# EAGLE design IO Shield_With_Power_Supply_PCB (EAGLE 6.4)
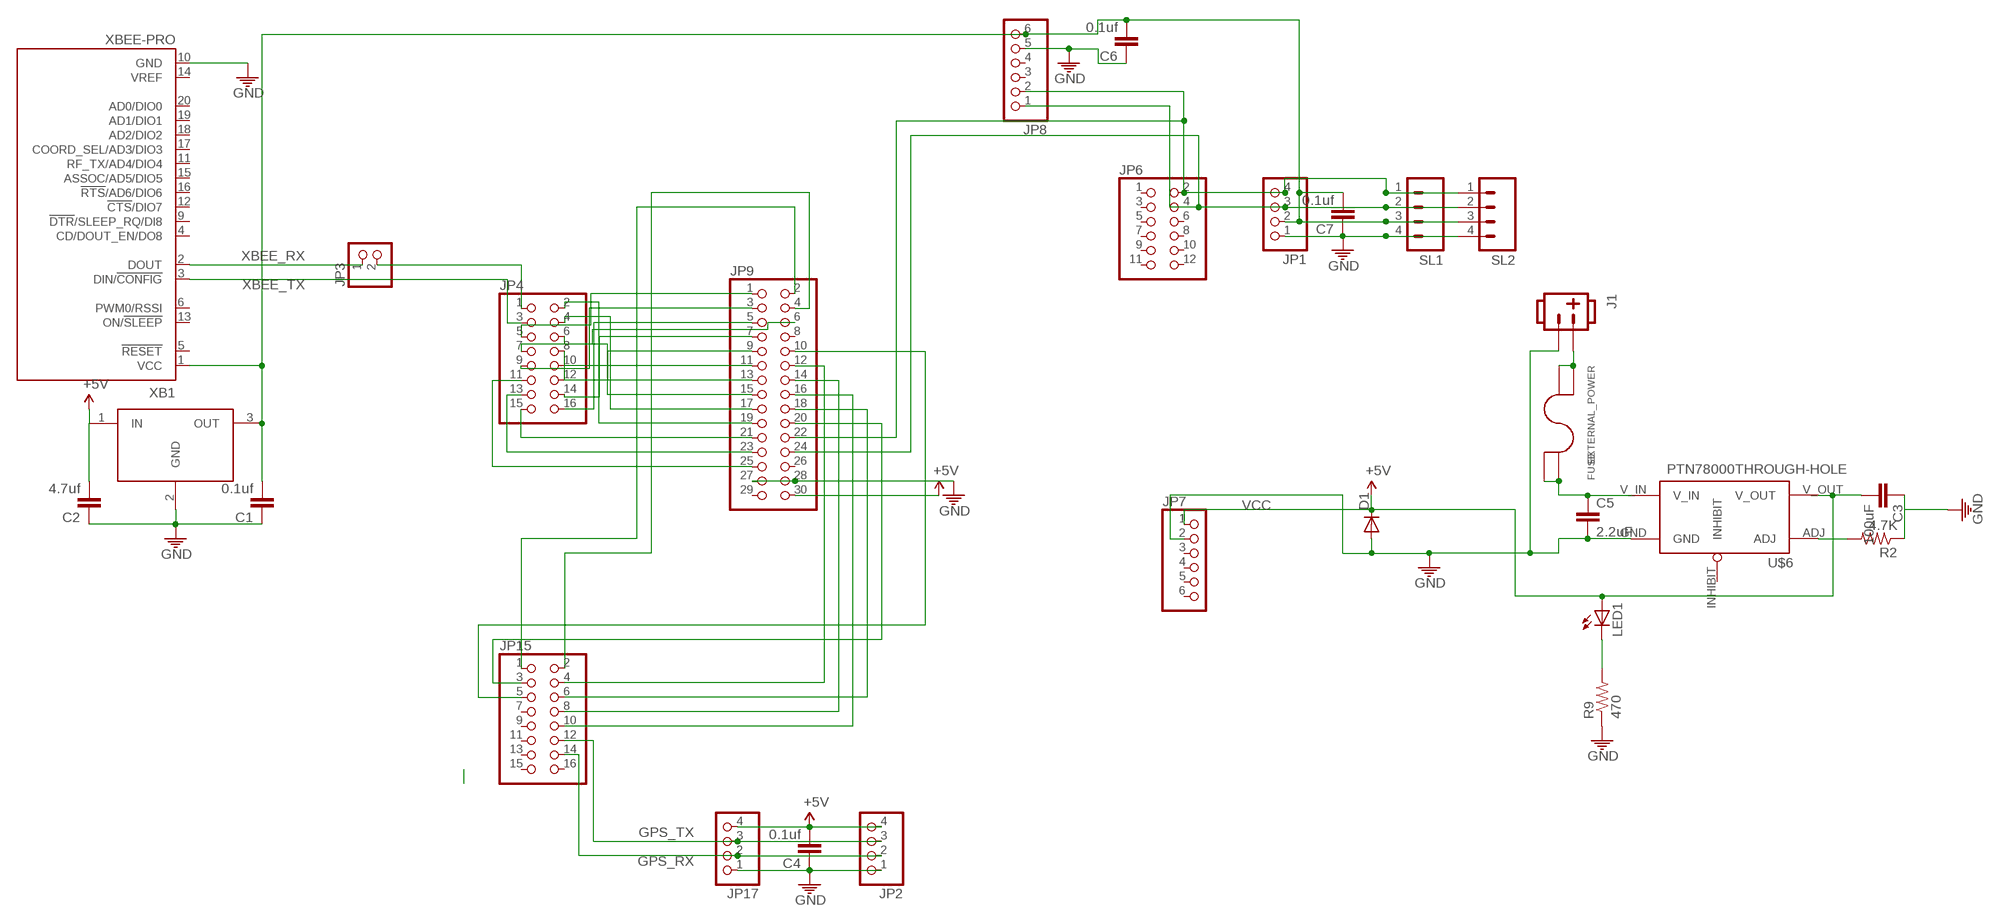
[diagram p0: schematic, sheet 1]

## Parts
C1  0.1uf  C-EUC0805  [C0805]
C2  4.7uf  C-EUC0805  [C0805]
C3  100uF  C-EUC0805  [C0805]
C4  0.1uf  C-EUC0805  [C0805]
C5  2.2uF  C-EUC0805  [C0805]
C6  0.1uf  C-EUC0805  [C0805]
C7  0.1uf  C-EUC0805  [C0805]
D1  DIODEPTH  [DIODE-1N4001]
EXTERNAL_POWER  FUSE  [FUSE_2AG]
J1  POW_CONNECTMALE  [SOCKET-MALE-3.96MM-2]
JP1  PINHD-1X4  [1X04]
JP2  PINHD-1X4/90  [1X04/90]
JP3  PINHD-1X2  [1X02]
JP4  PINHD-2X8  [2X08]
JP6  PINHD-2X6  [2X06]
JP7  PINHD-1X6  [1X06]
JP8  PINHD-1X6  [1X06]
JP9  PINHD-2X15/90  [2X15/90]
JP15  PINHD-2X8  [2X08]
JP17  PINHD-1X4  [1X04]
LED1  LED-FKIT-1206  [FKIT-LED-1206]
R2  4.7K  RESISTOR0805-RES  [0805]
R9  470  RESISTOR0805-RES  [0805]
SL1  M04LOCK  [1X04_LOCK]
SL2  M04LOCK  [1X04_LOCK]
U$6  PTN78000THROUGH-HOLE  [PTN78000]
U$7  LM3940IMP-3.3  [SOT223]
XB1  XBEE-PRO  [XBEE-PRO]

## Nets
GND: C1.1 C2.1 C3.1 C4.1 C5.2 C6.1 C7.1 D1.A J1.P$2 JP1.1 JP2.1 JP7.2 JP8.5 JP9.27 JP9.28 JP17.1 R2.1 R9.1 SL1.4 SL2.4 U$6.GND U$7.2(GND) XB1.10(GND)
GPS_RX: JP2.2 JP15.14 JP17.2
GPS_TX: JP2.3 JP15.12 JP17.3
N$1: JP3.1 XB1.2(DOUT)
N$2: JP4.5 JP9.1
N$3: EXTERNAL_POWER.P$1 EXTERNAL_POWER.P$2 J1.P$1
N$4: JP4.9 JP9.3
N$5: JP4.7 JP9.6
N$6: JP9.2 JP15.1
N$7: JP9.4 JP15.2
N$8: JP4.16 JP9.5
N$9: JP4.14 JP9.7
N$10: JP4.12 JP9.9
N$11: JP9.10 JP15.5
N$12: JP4.10 JP9.11
N$13: C1.2 C6.2 C7.2 JP1.2 JP8.6 SL1.3 SL2.3 U$7.3(OUT) XB1.1(VCC)
N$15: JP4.8 JP9.13
N$16: C5.1 EXTERNAL_POWER.P$3 EXTERNAL_POWER.P$4 U$6.V_IN
N$17: JP4.6 JP9.15
N$18: JP4.4 JP9.17
N$19: JP4.2 JP9.19
N$20: JP4.15 JP9.21
N$21: JP4.13 JP9.23
N$22: JP4.11 JP9.25
N$23: JP9.14 JP15.8
N$24: JP9.18 JP15.6
N$25: LED1.C R9.2
N$26: JP1.4 JP6.2 JP8.2 JP9.22 SL1.1 SL2.1
N$27: JP9.16 JP15.10
N$28: JP9.12 JP15.4
N$31: JP9.20 JP15.3
N$35: R2.2 U$6.ADJ
N$36: JP1.3 JP6.4 JP8.1 JP9.24 SL1.2 SL2.2
VCC: C2.2 C3.2 C4.2 D1.C JP2.4 JP7.1 JP9.30 JP17.4 LED1.A U$6.V_OUT U$7.1(IN) ; supply symbol labelled +5V
XBEE_RX: JP3.2 JP4.1
XBEE_TX: JP4.3 XB1.3(DIN/!CONFIG)
Unconnected: JP6.1 JP6.3 JP6.5 JP6.6 JP6.7 JP6.8 JP6.9 JP6.10 JP6.11 JP6.12 JP7.3 JP7.4 JP7.5 JP7.6 JP8.3 JP8.4 JP9.8 JP9.26 JP9.29 JP15.7 JP15.9 JP15.11 JP15.13 JP15.15 JP15.16 U$6.INHIBIT XB1.4(CD/DOUT_EN/DO8) XB1.5(!RESET) XB1.6(PWM0/RSSI) XB1.9(!DTR!/SLEEP_RQ/DI8) XB1.11(RF_TX/AD4/DIO4) XB1.12(!CTS!/DIO7) XB1.13(ON/!SLEEP) XB1.14(VREF) XB1.15(ASSOC/AD5/DIO5) XB1.16(!RTS!/AD6/DIO6) XB1.17(COORD_SEL/AD3/DIO3) XB1.18(AD2/DIO2) XB1.19(AD1/DIO1) XB1.20(AD0/DIO0)

## Library data of the parts
C1-C7 = resistor:C-EU: CAPACITOR, European symbol
D1 = ASL:DIODE: Diode These are standard reverse protection diodes and small signal diodes. SMA package can handle up to about 1A. SOD-323 can handle about 200mA. What the SOD-323 package when ordering, there are some mfgs out there that are 5-pin packages.
EXTERNAL_POWER = ASL:FUSE
J1 = ASL:POW_CONNECT
JP1 = pinhead_non_standard:PINHD-1X4: PIN HEADER
JP2 JP17 = pinhead:PINHD-1X4: PIN HEADER
JP3 = pinhead:PINHD-1X2: PIN HEADER
JP4 JP15 = pinhead:PINHD-2X8: PIN HEADER
JP6 = pinhead:PINHD-2X6: PIN HEADER
JP7 = pinhead:PINHD-1X6: PIN HEADER
JP8 = baro:PINHD-1X6: PIN HEADER
JP9 = pinhead:PINHD-2X15: PIN HEADER
LED1 = ASL:LED: LEDs Standard schematic elements and footprints for 5mm, 3mm, 1206, and 0603 sized LEDs. 5mm - Spark Fun Electronics SKU : COM-00529 (and others)
R2 R9 = ASL:RESISTOR: Resistor Basic schematic elements and footprints for 0603, 1206, and PTH resistors.
SL1 SL2 = ASL:M04: AMP QUICK CONNECTOR
U$6 = ASL:PTN78000: This is the PTN78000 part by Texas Instruments. It's a 1.5A adjustable switching regulator.
U$7 = LM3940:LM3940IMP-3.3: 1A Low Dropout Regulator for 5V to 3.3V Conversion
XB1 = maxstream:XBEE: XBee (TM) /XBee-PRO(TM) OEM RF Modules Source: MaxStream, Inc. xbee_productmanual.pdf; MPN: XBP24-AWI-001; OC_FARNELL: 1337916; OC_NEWARK: 42M2667

## Board
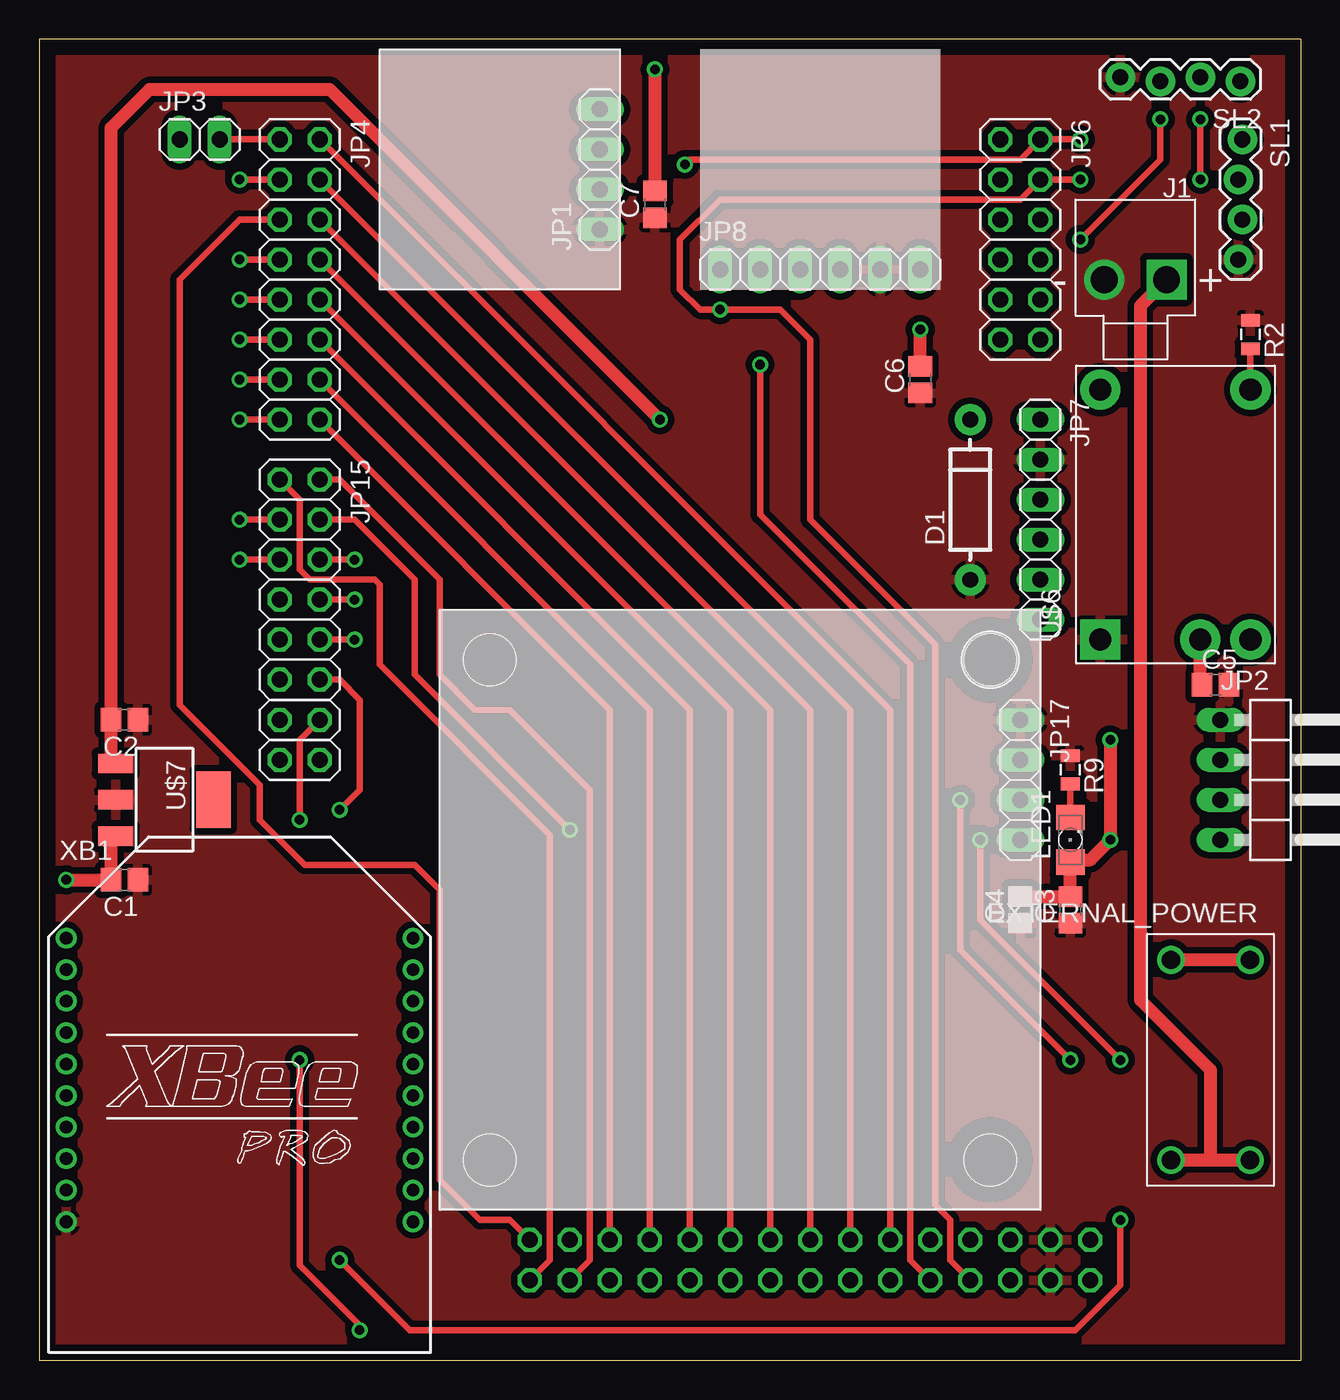
[diagram p1: board, top side]
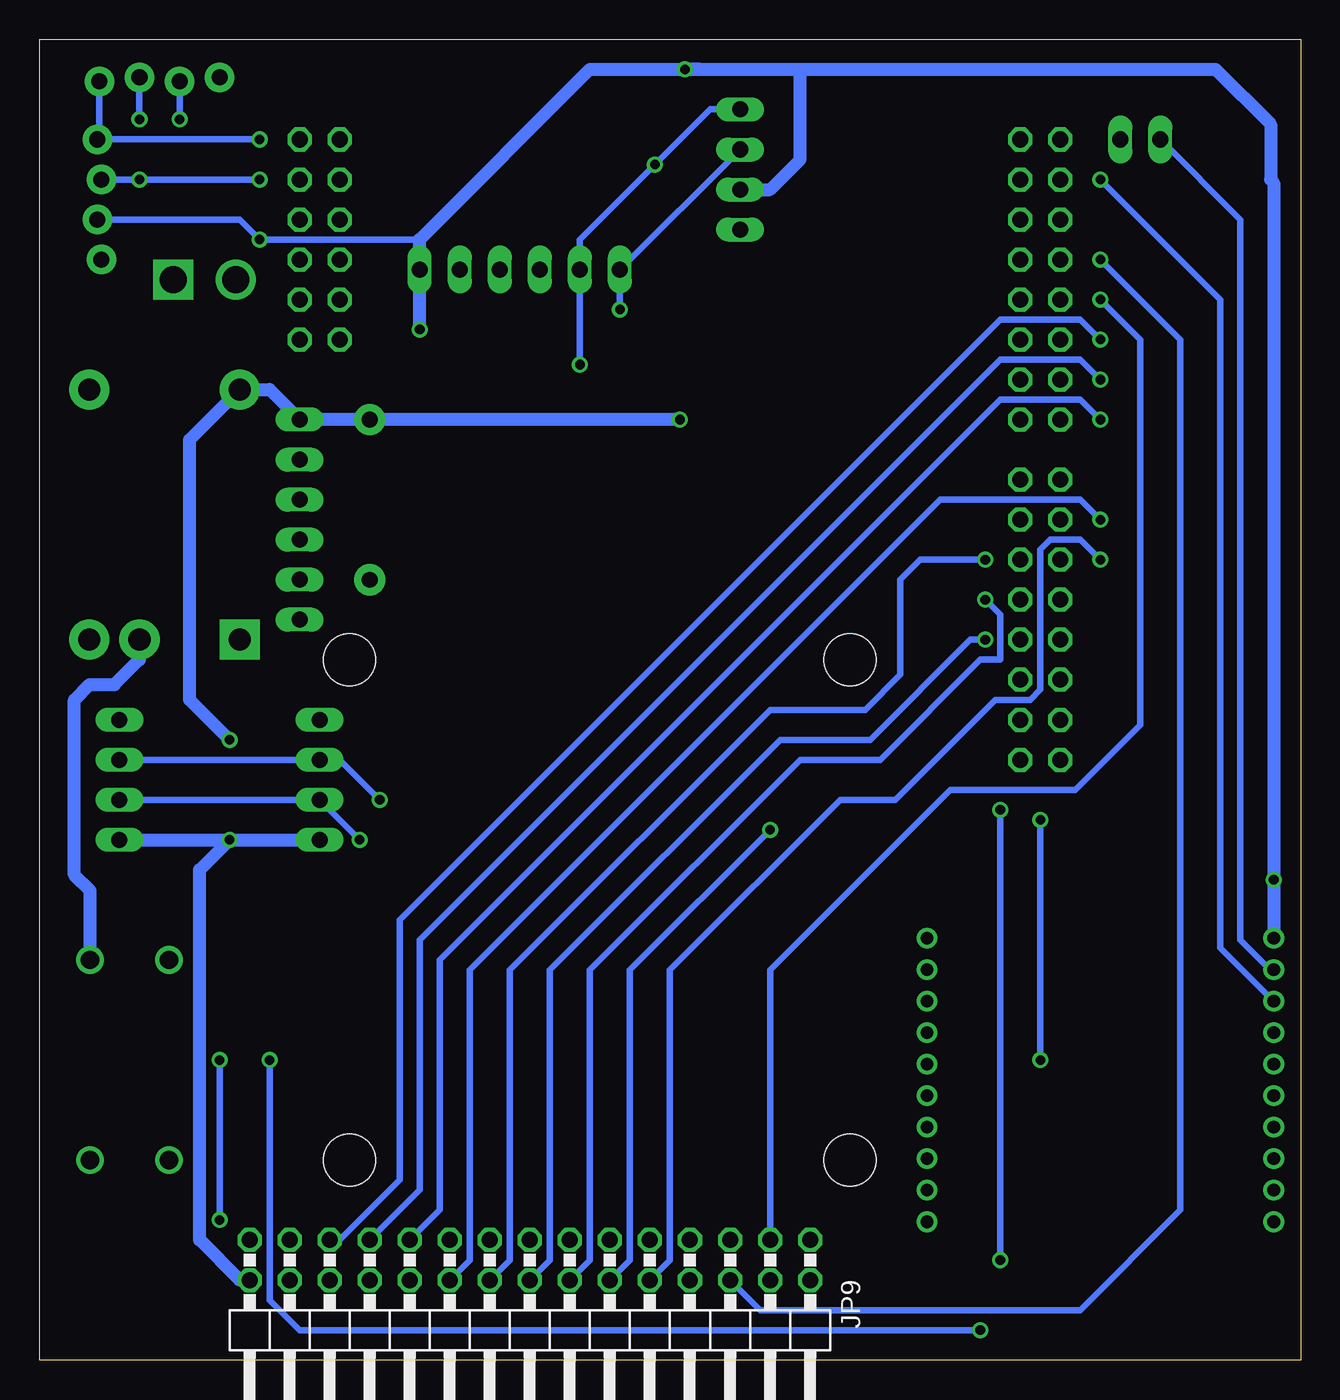
[diagram p2: board, bottom side, seen from below]

Size 80.01 x 83.82 mm. Coordinates in mm from the lower left corner, seen from the top.
Outline: 0,0 80.01,0 80.01,83.82 0,83.82 0,0
Copper layers (1*16): Top 0.035mm / dielectric 1.5mm / Bottom 0.035mm
Design rules "default *": minimum track width 10mil, minimum drill 24mil, track to track 8mil, track to pad 8mil, pad to pad 8mil, via to via 8mil, smd to smd 8mil, copper to edge 40mil, drill to drill 8mil, minimum pad ring 10mil, minimum via ring 8mil, stop-mask expansion 4mil, vias tented up to drill 0mil, thermal gap 10mil

### Footprints (pad centres in the part's own frame; a part is rotated, then mirrored left to right if it is on the bottom)
C0805 = smd 1.3 x 1.5: 1 -0.85,0; 2 0.85,0
DIODE-1N4001 = drill 1 pad 1.981: A -5.08,0; C 5.08,0
FUSE_2AG = drill 1.17: P$1 -2.5,6.35; P$2 2.5,6.35; P$3 -2.5,-6.35; P$4 2.5,-6.35
SOCKET-MALE-3.96MM-2 = drill 1.7 square: P$1 -1.98,0 | drill 1.7: P$2 1.98,0
1X04 = drill 1.016 long: 1 -3.175,0; 2 -0.635,0; 3 1.905,0; 4 4.445,0
1X04/90 = drill 1.016 long: 1 -3.81,-3.81; 2 -1.27,-3.81; 3 1.27,-3.81; 4 3.81,-3.81
1X02 = drill 1.016 long: 1 -1.27,0; 2 1.27,0
2X08 = drill 1.016 octagon: 1 -8.89,-1.27; 2 -8.89,1.27; 3 -6.35,-1.27; 4 -6.35,1.27; 5 -3.81,-1.27; 6 -3.81,1.27; 7 -1.27,-1.27; 8 -1.27,1.27; 9 1.27,-1.27; 10 1.27,1.27; 11 3.81,-1.27; 12 3.81,1.27; 13 6.35,-1.27; 14 6.35,1.27; 15 8.89,-1.27; 16 8.89,1.27
2X06 = drill 1.016 octagon: 1 -6.35,-1.27; 2 -6.35,1.27; 3 -3.81,-1.27; 4 -3.81,1.27; 5 -1.27,-1.27; 6 -1.27,1.27; 7 1.27,-1.27; 8 1.27,1.27; 9 3.81,-1.27; 10 3.81,1.27; 11 6.35,-1.27; 12 6.35,1.27
1X06 = drill 1.016 long: 1 -6.35,0; 2 -3.81,0; 3 -1.27,0; 4 1.27,0; 5 3.81,0; 6 6.35,0
2X15/90 = drill 1.016 octagon: 1 -17.78,-6.35; 2 -17.78,-3.81; 3 -15.24,-6.35; 4 -15.24,-3.81; 5 -12.7,-6.35; 6 -12.7,-3.81; 7 -10.16,-6.35; 8 -10.16,-3.81; 9 -7.62,-6.35; 10 -7.62,-3.81; 11 -5.08,-6.35; 12 -5.08,-3.81; 13 -2.54,-6.35; 14 -2.54,-3.81; 15 0,-6.35; 16 0,-3.81; 17 2.54,-6.35; 18 2.54,-3.81; 19 5.08,-6.35; 20 5.08,-3.81; 21 7.62,-6.35; 22 7.62,-3.81; 23 10.16,-6.35; 24 10.16,-3.81; 25 12.7,-6.35; 26 12.7,-3.81; 27 15.24,-6.35; 28 15.24,-3.81; 29 17.78,-6.35; 30 17.78,-3.81
FKIT-LED-1206 = smd 1.6 x 1.803: A -1.422,0; C 1.422,0
0805 = smd 0.8 x 1.2: 1 -0.9,0; 2 0.9,0
1X04_LOCK = drill 1.016 pad 1.88: 1 0,0.127; 2 2.54,-0.127; 3 5.08,0.127; 4 7.62,-0.127
STAND-OFF = hole 3.302: 0,0
PTN78000 = drill 1.397 pad 2.54: ADJ 15.875,-9.525; INHIBIT 0,-9.525; V_IN 0,-6.35; V_OUT 15.875,0 | drill 1.397 pad 2.54 square: GND 0,0
SOT223 = smd 1.219 x 2.235: 1 -2.311,-3.099; 2 0,-3.099; 3 2.311,-3.099 | smd 3.6 x 2.2: 4 0,3.099
XBEE-PRO = drill 0.8 pad 1.27: 1 -11,9; 2 -11,7; 3 -11,5; 4 -11,3; 5 -11,1; 6 -11,-1; 7 -11,-3; 8 -11,-5; 9 -11,-7; 10 -11,-9; 11 11,-9; 12 11,-7; 13 11,-5; 14 11,-3; 15 11,-1; 16 11,1; 17 11,3; 18 11,5; 19 11,7; 20 11,9

### Placement (x,y rotation side)
C1  5.4,30.48 180 top
C2  5.4,40.64 180 top
C3  65.41,28.57 90 top
C4  62.23,28.57 90 top
C5  74.61,42.86 0 top
C6  55.88,62.23 90 top
C7  39.05,73.34 90 top
D1  59.05,54.61 90 top
EXTERNAL_POWER  74.3,19.05 180 top
J1  69.53,68.58 180 top
JP1  35.56,74.93 90 top
JP2  78.74,36.83 270 top
JP3  10.16,77.47 0 top
JP4  16.51,68.58 270 top
JP6  62.23,71.12 270 top
JP7  63.5,53.34 270 top
JP8  49.53,69.21 0 top
JP9  48.89,1.27 180 bottom
JP15  16.51,46.99 270 top
JP17  62.23,37.47 270 top
LED1  65.41,33.02 90 top
R2  76.83,65.09 270 top
R9  65.41,37.47 270 top
SL1  76.2,77.47 270 top
SL2  76.2,81.28 180 top
U$2  [STAND-OFF]  60.33,12.7 0 top
U$3  [STAND-OFF]  28.57,12.7 0 top
U$4  [STAND-OFF]  28.57,44.45 0 top
U$5  [STAND-OFF]  60.33,44.45 0 top
U$6  67.31,45.72 90 top
U$7  7.94,35.56 270 top
XB1  12.7,17.78 0 top

### Tracks (layer width: path | path; a pad name or v marks a point on that pad's centre or on a via)
GND
  pour Top (isolate 0.406): 80.01,0 0,0 0,83.82 80.01,83.82
GPS_RX  (via drill 0.61)
  Top 0.406: v58.42,35.56 58.42,26.04 v65.41,19.05 | v20.32,1.91 20.32,2.22 16.51,6.03 v16.51,19.05 | JP15.14 16.51,39.37 v16.51,34.29
  Bottom 0.406: JP2.2 JP17.2 60.96,38.1 v58.42,35.56 | v65.41,19.05 65.41,3.81 63.5,1.91 v20.32,1.91 | v16.51,19.05 v16.51,34.29
GPS_TX  (via drill 0.61)
  Top 0.406: v59.69,33.02 59.69,27.94 v68.58,19.05 | v19.05,6.35 23.5,1.91 65.72,1.91 68.58,4.76 v68.58,8.89 | v19.05,34.93 20.32,36.2 20.32,41.91 19.05,43.18 JP15.12
  Bottom 0.406: JP2.3 JP17.3 v59.69,33.02 | v19.05,6.35 v19.05,34.93 | v68.58,19.05 v68.58,8.89
N$1
  Bottom 0.406: JP3.1 3.81,72.39 3.81,26.67 1.92,24.78 XB1.2
N$2
  Top 0.406: JP9.1 29.85,8.89 27.94,8.89 25.4,11.43 25.4,29.84 23.81,31.43 16.83,31.43 13.97,34.29 13.97,36.51 8.89,41.59 8.89,68.58 12.7,72.39 JP4.5
N$3
  Top 0.813: EXTERNAL_POWER.P$2 74.3,12.7 | 74.3,12.7 EXTERNAL_POWER.P$1 | J1.P$1 69.85,66.92 69.85,22.86 74.3,18.41 74.3,12.7
N$4  (via drill 0.61)
  Top 0.406: v12.7,67.31 JP4.9
  Bottom 0.406: JP9.3 33.66,24.77 22.23,36.2 14.29,36.2 10.16,40.32 10.16,64.77 v12.7,67.31
N$5  (via drill 0.61)
  Top 0.406: v12.7,69.85 JP4.7
  Bottom 0.406: JP9.6 34.29,3.17 13.97,3.17 7.62,9.53 7.62,64.77 v12.7,69.85
N$6
  Top 0.406: JP9.2 32.38,6.35 32.38,33.34 21.59,44.13 21.59,49.21 21.27,49.53 17.14,49.53 16.51,50.17 16.51,54.61 JP15.1
N$7
  Top 0.406: JP9.4 34.92,6.35 34.92,36.2 29.85,41.28 27.62,41.28 25.4,43.5 25.4,49.53 19.05,55.88 JP15.2
N$8
  Top 0.406: JP9.5 36.2,41.28 JP4.16
N$9
  Top 0.406: JP9.7 38.73,41.28 JP4.14
N$10
  Top 0.406: JP4.12 41.27,41.28 JP9.9
N$11  (via drill 0.61)
  Top 0.406: v12.7,50.8 JP15.5
  Bottom 0.406: JP9.10 40,6.35 40,24.77 29.21,35.56 25.72,35.56 19.37,41.91 17.14,41.91 16.51,42.55 16.51,51.44 15.87,52.07 13.97,52.07 v12.7,50.8
N$12
  Top 0.406: JP4.10 43.81,41.28 JP9.11
N$13  (via drill 0.61)
  Top 0.406: v71.12,78.74 71.12,76.2 v66.04,71.12
  Top 0.813: v1.7,30.48 C1.2 4.55,32.96 U$7.3 | C6.2 v55.88,65.41 | v39.05,81.91 C7.2
  Bottom 0.406: 55.88,71.12 v66.04,71.12 67.31,72.39 SL1.3 | SL2.3 v71.12,78.74
  Bottom 0.813: 38.1,81.91 v39.05,81.91 | v39.05,81.91 31.75,81.91 | 31.75,81.91 5.4,81.91 1.9,78.42 1.9,74.93 1.7,74.72 v1.7,30.48 XB1.1 | v39.05,81.91 45.09,81.91 55.88,71.12 JP8.6 v55.88,65.41 | JP1.2 33.66,74.3 31.75,76.2 31.75,81.91
N$15
  Top 0.406: JP4.8 46.35,41.28 JP9.13
N$16
  Top 0.813: EXTERNAL_POWER.P$3 EXTERNAL_POWER.P$4 | C5.1 73.66,42.97 U$6.V_IN
  Bottom 0.813: EXTERNAL_POWER.P$3 76.8,29.8 77.79,30.8 77.79,41.91 76.83,42.86 75.25,42.86 73.66,44.45 U$6.V_IN
N$17
  Top 0.406: JP4.6 48.89,41.28 JP9.15
N$18
  Top 0.406: JP4.4 51.43,41.28 JP9.17
N$19
  Top 0.406: JP9.19 53.97,41.28 JP4.2
N$20  (via drill 0.61)
  Top 0.406: v12.7,59.69 JP4.15
  Bottom 0.406: JP9.21 54.61,9.53 54.61,25.4 19.05,60.96 13.97,60.96 v12.7,59.69
N$21  (via drill 0.61)
  Top 0.406: v12.7,62.23 JP4.13
  Bottom 0.406: JP9.23 55.88,10.79 55.88,26.67 19.05,63.5 13.97,63.5 v12.7,62.23
N$22  (via drill 0.61)
  Top 0.406: v12.7,64.77 JP4.11
  Bottom 0.406: JP9.25 60.96,7.62 57.15,11.43 57.15,27.94 19.05,66.04 13.97,66.04 v12.7,64.77
N$23  (via drill 0.61)
  Top 0.406: v20,48.26 JP15.8
  Bottom 0.406: JP9.14 45.09,6.35 45.09,24.77 31.75,38.1 26.67,38.1 20.32,44.45 19.05,44.45 19.05,47.31 v20,48.26
N$24  (via drill 0.61)
  Top 0.406: v20,50.8 JP15.6
  Bottom 0.406: JP9.18 50.16,6.35 50.16,24.77 33.66,41.28 27.62,41.28 25.4,43.5 25.4,49.53 24.13,50.8 v20,50.8
N$25
  Top 0.406: LED1.C R9.2
N$26  (via drill 0.61)
  Top 0.406: JP9.22 55.24,6.35 55.24,44.13 45.72,53.66 v45.72,63.18 | v40.96,75.88 41.27,76.2 62.23,76.2 JP6.2 v66.04,77.47
  Bottom 0.406: v45.72,63.18 JP8.2 45.72,71.12 v40.96,75.88 37.46,79.38 JP1.4 | v66.04,77.47 SL1.1 76.2,77.6 SL2.1
N$27  (via drill 0.61)
  Top 0.406: v20,45.72 JP15.10
  Bottom 0.406: JP9.16 47.62,6.35 47.62,24.77 33.02,39.37 27.3,39.37 20.96,45.72 v20,45.72
N$28  (via drill 0.61)
  Top 0.406: JP15.4 20,53.34 23.81,49.53 23.81,43.5 v33.66,33.66
  Bottom 0.406: v33.66,33.66 42.54,24.77 42.54,6.35 JP9.12
N$31  (via drill 0.61)
  Top 0.406: v12.7,53.34 JP15.3
  Bottom 0.406: JP9.20 52.7,6.35 52.7,24.77 22.86,54.61 13.97,54.61 v12.7,53.34
N$35
  Top 0.406: U$6.ADJ R2.2
N$36  (via drill 0.61)
  Top 0.406: JP9.24 57.78,6.35 57.78,8.89 56.83,9.84 56.83,45.4 48.89,53.34 48.89,64.77 46.99,66.67 v43.18,66.67 41.91,66.67 40.64,67.94 40.64,71.12 43.18,73.66 62.23,73.66 JP6.4 v66.04,74.93 | v73.66,78.74 v73.66,74.93
  Bottom 0.406: v43.18,66.67 JP8.1 JP1.3 | v66.04,74.93 v73.66,74.93 SL1.2 | SL2.2 v73.66,78.74
VCC  (via drill 0.61)
  Top 0.406: 65.25,31.75 LED1.A
  Top 0.813: v67.94,39.37 v67.94,33.02 66.67,31.75 65.25,31.75 | U$7.1 4.55,38.16 C2.2 4.55,78.21 6.98,80.64 18.42,80.64 v39.37,59.69 | C4.2 C3.2 LED1.A
  Bottom 0.813: JP2.4 v67.94,33.02 | v67.94,33.02 JP17.4 | v39.37,59.69 D1.C JP7.1 65.41,61.6 U$6.V_OUT 70.48,58.42 70.48,41.91 v67.94,39.37 | v67.94,33.02 69.85,31.11 69.85,7.62 67.31,5.08 JP9.30
XBEE_RX
  Top 0.406: JP4.1 JP3.2
XBEE_TX  (via drill 0.61)
  Top 0.406: v12.7,74.93 JP4.3
  Bottom 0.406: XB1.3 5.08,26.16 5.08,67.31 v12.7,74.93